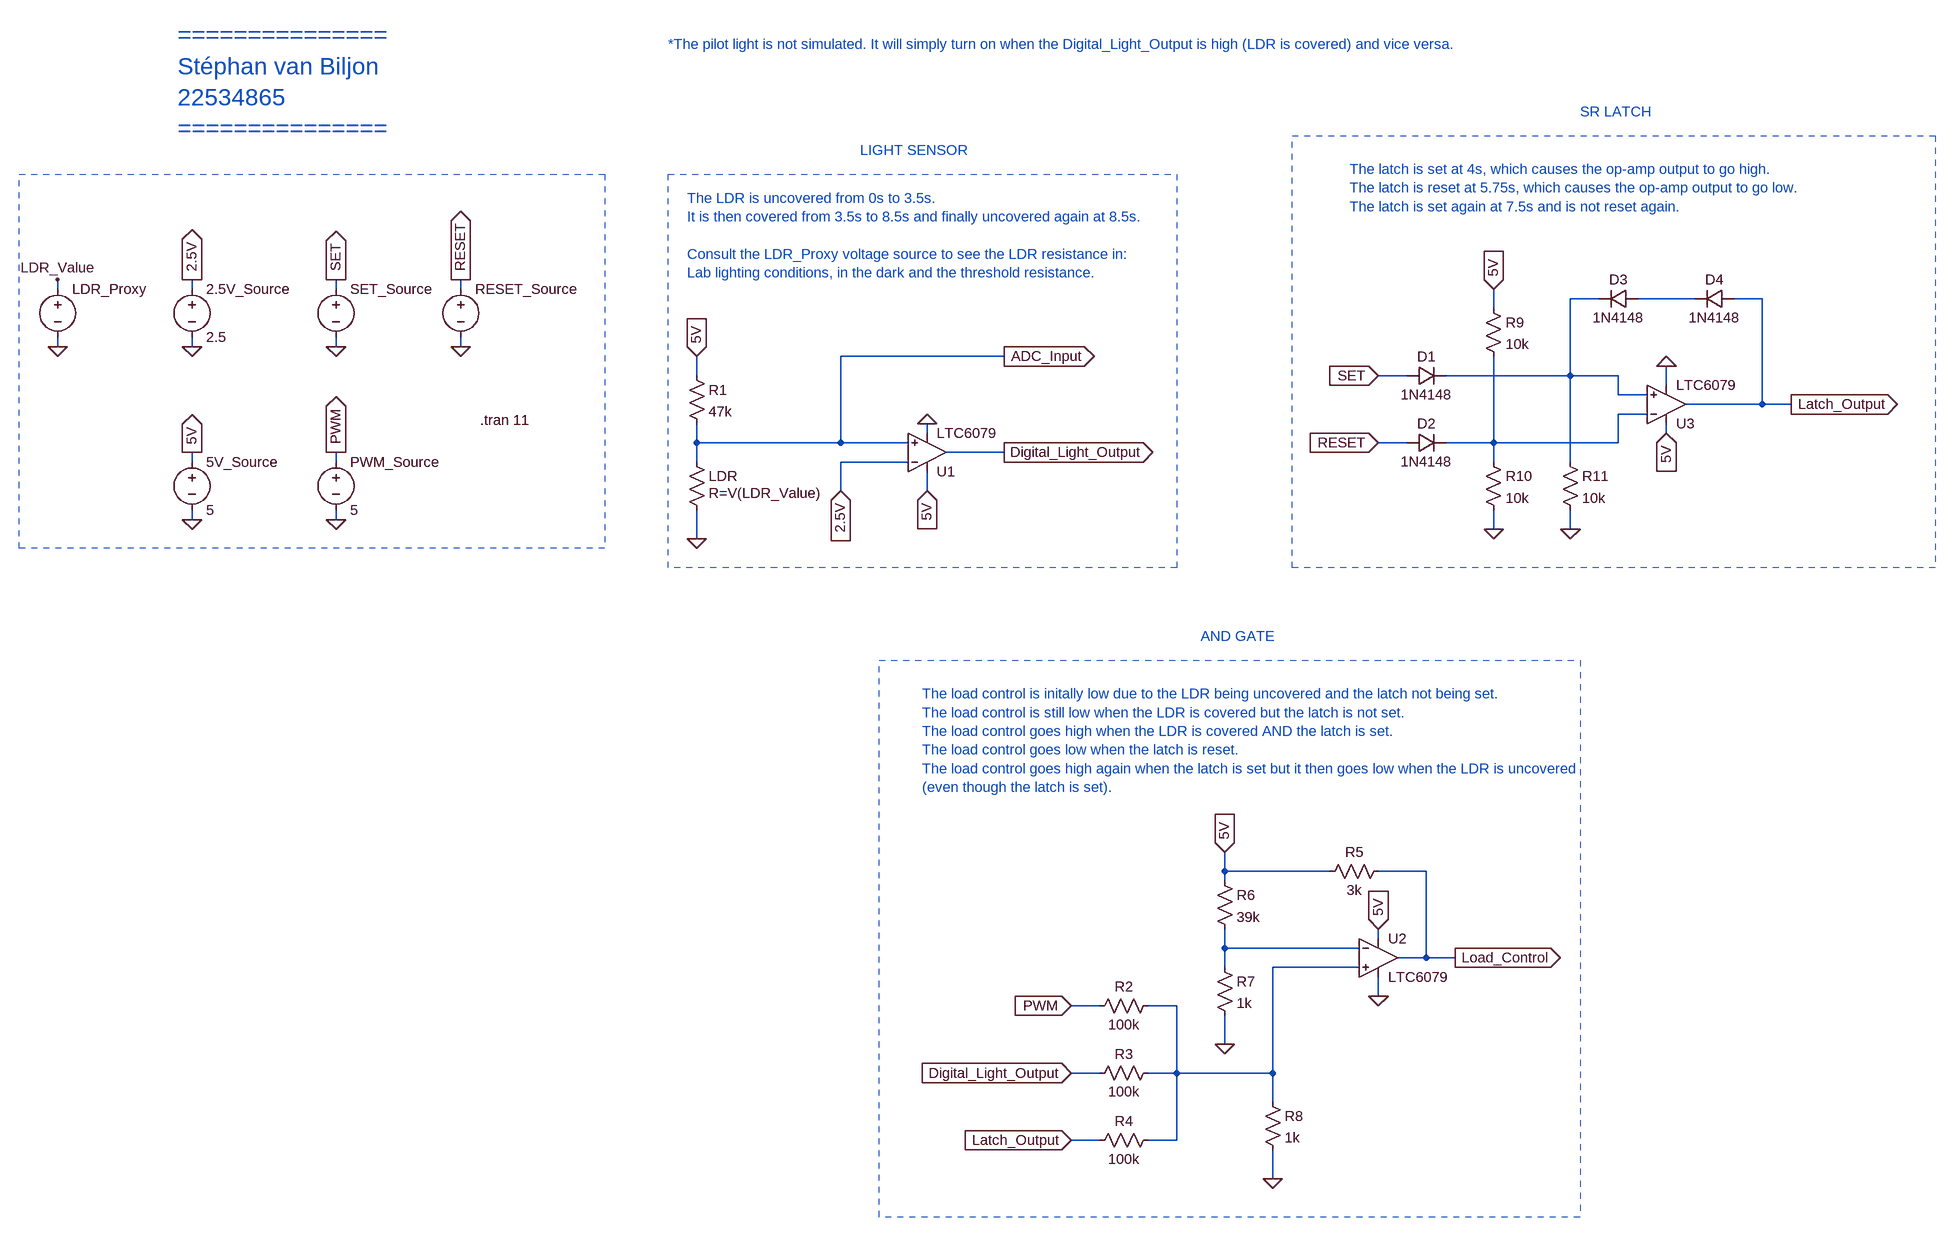
[diagram p0: schematic E344_22534865_A7.asc]
E344_22534865_A7.asc, the LTspice schematic file:
Version 4
SHEET 1 6596 1940
WIRE -816 144 -816 128
WIRE -592 144 -592 128
WIRE -352 144 -352 128
WIRE -144 144 -144 128
WIRE 1840 160 1792 160
WIRE 2000 160 1904 160
WIRE 2112 160 2064 160
WIRE 1664 176 1664 144
WIRE -816 240 -816 224
WIRE -592 240 -592 224
WIRE -352 240 -352 224
WIRE -144 240 -144 224
WIRE 848 256 576 256
WIRE 336 288 336 256
WIRE 1520 288 1472 288
WIRE 1792 288 1792 160
WIRE 1792 288 1584 288
WIRE 1872 288 1792 288
WIRE 1952 304 1952 272
WIRE 1872 320 1872 288
WIRE 1920 320 1872 320
WIRE 2112 336 2112 160
WIRE 2112 336 1984 336
WIRE 2160 336 2112 336
WIRE 1920 352 1872 352
WIRE 720 384 720 368
WIRE 1952 384 1952 368
WIRE 336 400 336 368
WIRE 576 400 576 256
WIRE 576 400 336 400
WIRE 688 400 576 400
WIRE 1520 400 1472 400
WIRE 1664 400 1664 256
WIRE 1664 400 1584 400
WIRE 1872 400 1872 352
WIRE 1872 400 1664 400
WIRE 848 416 752 416
WIRE -592 432 -592 416
WIRE -352 432 -352 416
WIRE 336 432 336 400
WIRE 688 432 576 432
WIRE 1664 432 1664 400
WIRE 1792 432 1792 288
WIRE 576 480 576 432
WIRE 720 480 720 448
WIRE -592 528 -592 512
WIRE -352 528 -352 512
WIRE 1664 544 1664 512
WIRE 1792 544 1792 512
WIRE 336 560 336 512
WIRE 1216 1136 1216 1104
WIRE 1392 1136 1216 1136
WIRE 1552 1136 1472 1136
WIRE 1216 1152 1216 1136
WIRE 1472 1248 1472 1232
WIRE 1216 1264 1216 1232
WIRE 1440 1264 1216 1264
WIRE 1552 1280 1552 1136
WIRE 1552 1280 1504 1280
WIRE 1600 1280 1552 1280
WIRE 1216 1296 1216 1264
WIRE 1440 1296 1296 1296
WIRE 1472 1344 1472 1312
WIRE 1008 1360 960 1360
WIRE 1136 1360 1088 1360
WIRE 1216 1424 1216 1376
WIRE 1008 1472 960 1472
WIRE 1136 1472 1136 1360
WIRE 1136 1472 1088 1472
WIRE 1296 1472 1296 1296
WIRE 1296 1472 1136 1472
WIRE 1296 1520 1296 1472
WIRE 1008 1584 960 1584
WIRE 1136 1584 1136 1472
WIRE 1136 1584 1088 1584
WIRE 1296 1648 1296 1600
FLAG -592 416 5V
IOPIN -592 416 Out
FLAG 336 256 5V
IOPIN 336 256 In
FLAG 336 560 0
FLAG 848 416 Digital_Light_Output
IOPIN 848 416 Out
FLAG 848 256 ADC_Input
IOPIN 848 256 Out
FLAG -592 128 2.5V
IOPIN -592 128 Out
FLAG -592 240 0
FLAG 720 368 0
FLAG 720 480 5V
IOPIN 720 480 In
FLAG 576 480 2.5V
IOPIN 576 480 In
FLAG -816 240 0
FLAG -816 128 LDR_Value
FLAG 960 1360 PWM
IOPIN 960 1360 In
FLAG 960 1472 Digital_Light_Output
IOPIN 960 1472 In
FLAG 960 1584 Latch_Output
IOPIN 960 1584 In
FLAG 1296 1648 0
FLAG 1216 1424 0
FLAG 1216 1104 5V
IOPIN 1216 1104 In
FLAG 1472 1232 5V
IOPIN 1472 1232 In
FLAG 1472 1344 0
FLAG 1600 1280 Load_Control
IOPIN 1600 1280 Out
FLAG -352 240 0
FLAG -144 240 0
FLAG -352 128 SET
IOPIN -352 128 Out
FLAG -144 128 RESET
IOPIN -144 128 Out
FLAG 1664 144 5V
IOPIN 1664 144 In
FLAG 1664 544 0
FLAG 1792 544 0
FLAG 1952 384 5V
IOPIN 1952 384 In
FLAG 1952 272 0
FLAG 2160 336 Latch_Output
IOPIN 2160 336 Out
FLAG 1472 288 SET
IOPIN 1472 288 In
FLAG 1472 400 RESET
IOPIN 1472 400 In
FLAG -352 416 PWM
IOPIN -352 416 Out
FLAG -352 528 0
FLAG -592 528 0
SYMBOL res 320 416 R0
WINDOW 3 36 68 Left 2
SYMATTR InstName LDR
SYMATTR Value R=V(LDR_Value)
SYMBOL res 320 272 R0
SYMATTR InstName R1
SYMATTR Value 47k
SYMBOL Opamps\\LTC6079 720 416 M180
SYMATTR InstName U1
SYMBOL voltage -592 128 R0
WINDOW 123 0 0 Left 0
WINDOW 39 0 0 Left 0
SYMATTR InstName 2.5V_Source
SYMATTR Value 2.5
SYMBOL voltage -816 128 R0
WINDOW 3 24 44 Invisible 2
WINDOW 123 0 0 Left 0
WINDOW 39 0 0 Left 0
SYMATTR InstName LDR_Proxy
SYMATTR Value PWL(1 7k 3.5 7k 3.50001 330k 6 330k 6.0001 47.001k 8.5 47.001k 8.50001 7k)
SYMBOL Opamps\\LTC6079 1472 1280 R0
SYMATTR InstName U2
SYMBOL res 1104 1344 R90
WINDOW 0 0 56 VBottom 2
WINDOW 3 32 56 VTop 2
SYMATTR InstName R2
SYMATTR Value 100k
SYMBOL res 1104 1456 R90
WINDOW 0 0 56 VBottom 2
WINDOW 3 32 56 VTop 2
SYMATTR InstName R3
SYMATTR Value 100k
SYMBOL res 1104 1568 R90
WINDOW 0 0 56 VBottom 2
WINDOW 3 32 56 VTop 2
SYMATTR InstName R4
SYMATTR Value 100k
SYMBOL res 1488 1120 R90
WINDOW 0 0 56 VBottom 2
WINDOW 3 32 56 VTop 2
SYMATTR InstName R5
SYMATTR Value 3k
SYMBOL res 1200 1136 R0
SYMATTR InstName R6
SYMATTR Value 39k
SYMBOL res 1200 1280 R0
SYMATTR InstName R7
SYMATTR Value 1k
SYMBOL res 1280 1504 R0
SYMATTR InstName R8
SYMATTR Value 1k
SYMBOL diode 2064 144 R90
WINDOW 0 0 32 VBottom 2
WINDOW 3 32 32 VTop 2
SYMATTR InstName D4
SYMATTR Value 1N4148
SYMBOL Opamps\\LTC6079 1952 336 M180
SYMATTR InstName U3
SYMBOL diode 1904 144 R90
WINDOW 0 0 32 VBottom 2
WINDOW 3 32 32 VTop 2
SYMATTR InstName D3
SYMATTR Value 1N4148
SYMBOL diode 1520 304 R270
WINDOW 0 32 32 VTop 2
WINDOW 3 0 32 VBottom 2
SYMATTR InstName D1
SYMATTR Value 1N4148
SYMBOL diode 1520 416 R270
WINDOW 0 32 32 VTop 2
WINDOW 3 0 32 VBottom 2
SYMATTR InstName D2
SYMATTR Value 1N4148
SYMBOL voltage -352 128 R0
WINDOW 3 24 96 Invisible 2
WINDOW 123 0 0 Left 0
WINDOW 39 0 0 Left 0
SYMATTR InstName SET_Source
SYMATTR Value PWL(0 0 4 0 4.0001 5 4.5 5 4.50001 0 7.5 0 7.50001 5 8 5 8.0001 0)
SYMBOL voltage -144 128 R0
WINDOW 3 24 96 Invisible 2
WINDOW 123 0 0 Left 0
WINDOW 39 0 0 Left 0
SYMATTR InstName RESET_Source
SYMATTR Value PWL(0 0 5.75 0 5.750001 5 6.25 5 6.250001 0)
SYMBOL res 1648 160 R0
SYMATTR InstName R9
SYMATTR Value 10k
SYMBOL res 1648 416 R0
SYMATTR InstName R10
SYMATTR Value 10k
SYMBOL res 1776 416 R0
SYMATTR InstName R11
SYMATTR Value 10k
SYMBOL voltage -352 416 R0
WINDOW 123 0 0 Left 0
WINDOW 39 0 0 Left 0
SYMATTR InstName PWM_Source
SYMATTR Value 5
SYMBOL voltage -592 416 R0
WINDOW 123 0 0 Left 0
WINDOW 39 0 0 Left 0
SYMATTR InstName 5V_Source
SYMATTR Value 5
TEXT -112 362 Left 2 !.tran 11
TEXT -616 -280 Left 4 ;===============\nStéphan van Biljon\n22534865\n===============
TEXT 320 -8 Left 2 ;The LDR is uncovered from 0s to 3.5s. \nIt is then covered from 3.5s to 8.5s and finally uncovered again at 8.5s.\n \nConsult the LDR_Proxy voltage source to see the LDR resistance in: \nLab lighting conditions, in the dark and the threshold resistance.
TEXT 608 -88 Left 2 ;LIGHT SENSOR
TEXT 1176 744 Left 2 ;AND GATE
TEXT 1808 -152 Left 2 ;SR LATCH
TEXT 1424 -56 Left 2 ;The latch is set at 4s, which causes the op-amp output to go high.\nThe latch is reset at 5.75s, which causes the op-amp output to go low.\nThe latch is set again at 7.5s and is not reset again.
TEXT 712 840 Left 2 ;The load control is initally low due to the LDR being uncovered and the latch not being set.\nThe load control is still low when the LDR is covered but the latch is not set.\nThe load control goes high when the LDR is covered AND the latch is set.\nThe load control goes low when the latch is reset.\nThe load control goes high again when the latch is set but it then goes low when the LDR is uncovered \n(even though the latch is set).
TEXT 288 -264 Left 2 ;*The pilot light is not simulated. It will simply turn on when the Digital_Light_Output is high (LDR is covered) and vice versa.
RECTANGLE Normal 1136 608 288 -48 2
RECTANGLE Normal 2400 608 1328 -112 2
RECTANGLE Normal 1808 1712 640 784 2
RECTANGLE Normal 96 576 -880 -48 2

The netlist it stands for:
* E344_22534865_A7.asc
R§LDR ADC_Input 0 R=V(LDR_Value)
R1 5V ADC_Input 47k
XU1 ADC_Input 2.5V 5V 0 Digital_Light_Output LTC6078  ; LTC6079, pins In+ In- V+ V- OUT
V§2.5V_Source 2.5V 0 2.5
V§LDR_Proxy LDR_Value 0 PWL(1 7k 3.5 7k 3.50001 330k 6 330k 6.0001 47.001k 8.5 47.001k 8.50001 7k)
XU2 N005 N004 5V 0 Load_Control LTC6078  ; LTC6079, pins In+ In- V+ V- OUT
R2 N005 PWM 100k
R3 N005 Digital_Light_Output 100k
R4 N005 Latch_Output 100k
R5 Load_Control 5V 3k
R6 5V N004 39k
R7 N004 0 1k
R8 N005 0 1k
D4 Latch_Output N002 1N4148
XU3 N001 N003 5V 0 Latch_Output LTC6078  ; LTC6079, pins In+ In- V+ V- OUT
D3 N002 N001 1N4148
D1 SET N001 1N4148
D2 RESET N003 1N4148
V§SET_Source SET 0 PWL(0 0 4 0 4.0001 5 4.5 5 4.50001 0 7.5 0 7.50001 5 8 5 8.0001 0)
V§RESET_Source RESET 0 PWL(0 0 5.75 0 5.750001 5 6.25 5 6.250001 0)
R9 5V N003 10k
R10 N003 0 10k
R11 N001 0 10k
V§PWM_Source PWM 0 5
V§5V_Source 5V 0 5
.model D D
.lib standard.dio
.tran 11
* ===============
* Stéphan van Biljon
* 22534865
* ===============
* The LDR is uncovered from 0s to 3.5s.
* It is then covered from 3.5s to 8.5s and finally uncovered again at 8.5s.
* Consult the LDR_Proxy voltage source to see the LDR resistance in:
* Lab lighting conditions, in the dark and the threshold resistance.
* LIGHT SENSOR
* AND GATE
* SR LATCH
* The latch is set at 4s, which causes the op-amp output to go high.
* The latch is reset at 5.75s, which causes the op-amp output to go low.
* The latch is set again at 7.5s and is not reset again.
* The load control is initally low due to the LDR being uncovered and the latch not being set.
* The load control is still low when the LDR is covered but the latch is not set.
* The load control goes high when the LDR is covered AND the latch is set.
* The load control goes low when the latch is reset.
* The load control goes high again when the latch is set but it then goes low when the LDR is uncovered
* (even though the latch is set).
* *The pilot light is not simulated. It will simply turn on when the Digital_Light_Output is high (LDR is covered) and vice versa.
.lib LTC5.lib
.backanno
.end